# Altium schematic sheet Zigbee_Transceiver_CC2530.SchDoc: Zigbee Transceiver CC2530
size A4; MaxVIN: 3V6; MinVIN: 2V0
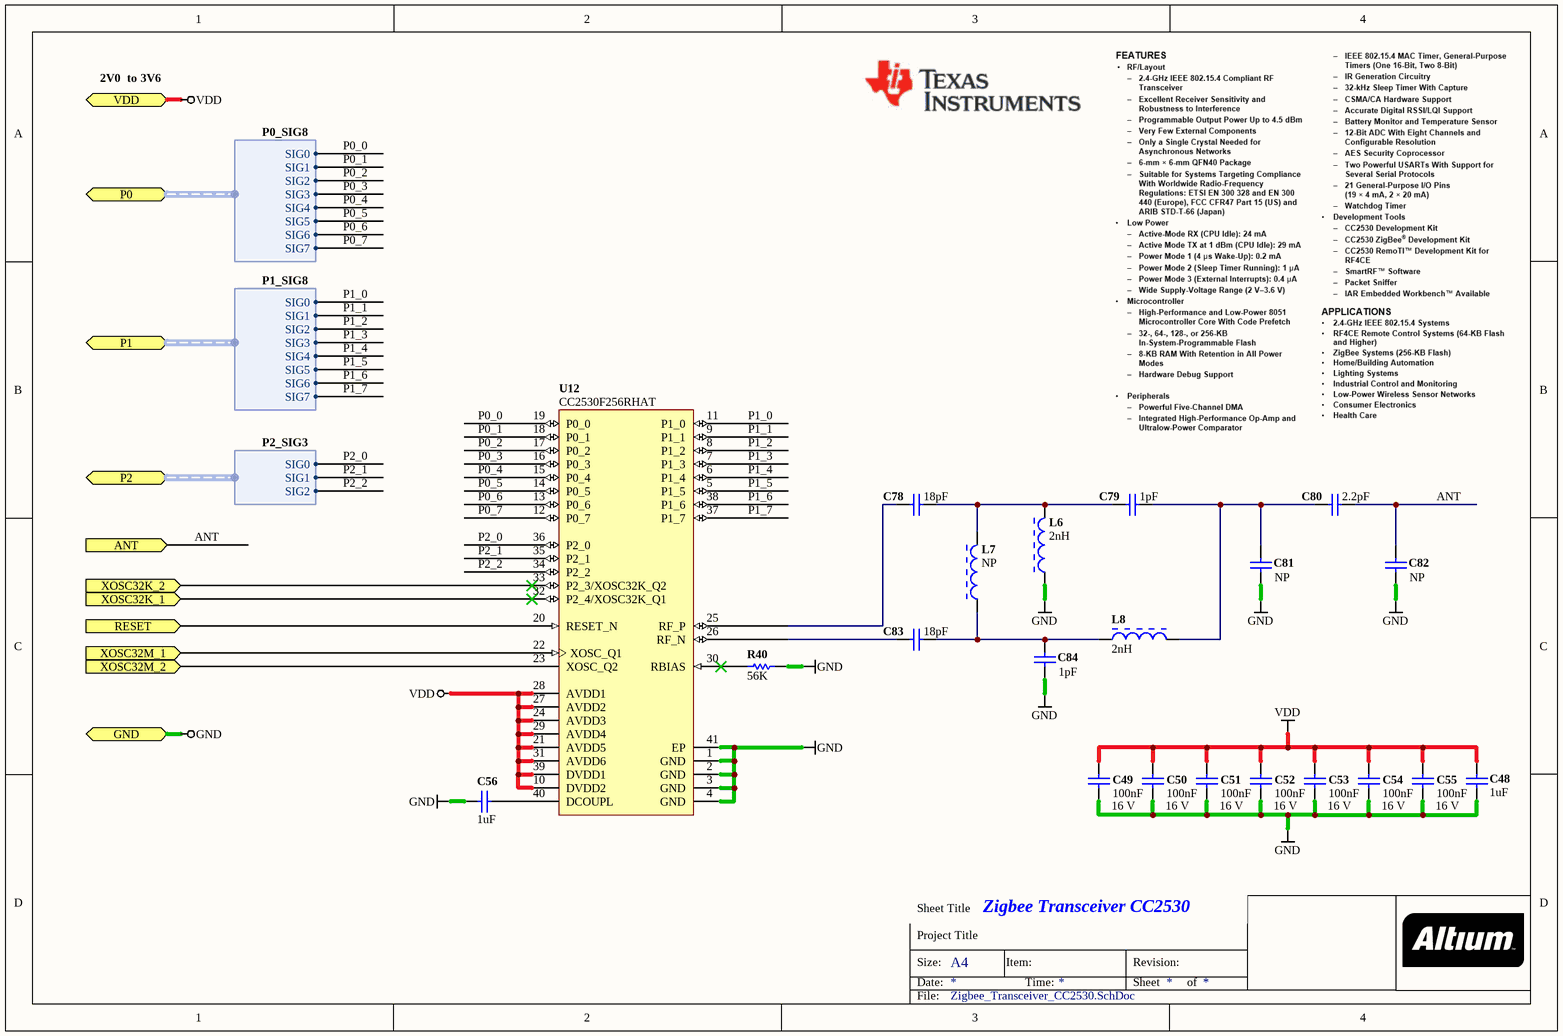
[diagram p0: Zigbee_Transceiver_CC2530.SchDoc]

## Parts
C48  value 1uF  [CAPC0402(1005)60_N]  (hidden comment: CAP 1uF 10V 0402(1005))
C49  value 100nF  Rated Voltage: 16 V  [CAPC0402(1005)60_N]  (hidden comment: CAP 100nF 16V 0402(1005))
C50  value 100nF  Rated Voltage: 16 V  [CAPC0402(1005)60_N]  (hidden comment: CAP 100nF 16V 0402(1005))
C51  value 100nF  Rated Voltage: 16 V  [CAPC0402(1005)60_N]  (hidden comment: CAP 100nF 16V 0402(1005))
C52  value 100nF  Rated Voltage: 16 V  [CAPC0402(1005)60_N]  (hidden comment: CAP 100nF 16V 0402(1005))
C53  value 100nF  Rated Voltage: 16 V  [CAPC0402(1005)60_N]  (hidden comment: CAP 100nF 16V 0402(1005))
C54  value 100nF  Rated Voltage: 16 V  [CAPC0402(1005)60_N]  (hidden comment: CAP 100nF 16V 0402(1005))
C55  value 100nF  Rated Voltage: 16 V  [CAPC0402(1005)60_N]  (hidden comment: CAP 100nF 16V 0402(1005))
C56  value 1uF  [CAPC0402(1005)60_N]  (hidden comment: CAP 1uF 10V 0402(1005))
C78  value 18pF  [CAPC0402(1005)60_N]  (hidden comment: CAP 18pF 25V 0402(1005))
C79  value 1pF  [CAPC0402(1005)60_L]  (hidden comment: CAP 1pF 25V 0402(1005))
C80  value 2.2pF  [CAPC0402(1005)60_L]  (hidden comment: CAP 2.2pF 25V 0402(1005))
C81  NP  [CAPC0402(1005)60_L]
C82  NP  [CAPC0402(1005)60_L]
C83  value 18pF  [CAPC0402(1005)60_N]  (hidden comment: CAP 18pF 25V 0402(1005))
C84  value 1pF  [CAPC0402(1005)60_L]  (hidden comment: CAP 1pF 25V 0402(1005))
L6  2nH  [MURA-IND0402_V]
L7  NP  [MURA-IND0402_V]
L8  2nH  [MURA-IND0402_V]
R40  56K  [RESC0402(1005)_N]
U12  CC2530F256RHAT  [TI-RHA40-4500X4500TP_V]

## Ports
ANT (in), GND, P0 (harness P0_SIG8), P1 (harness P1_SIG8), P2 (harness P2_SIG3), RESET (in), VDD, XOSC32K_1 (in), XOSC32K_2 (in), XOSC32M_1 (in), XOSC32M_2 (in)

## Harnesses
P0_SIG8: SIG0, SIG1, SIG2, SIG3, SIG4, SIG5, SIG6, SIG7
P1_SIG8: SIG0, SIG1, SIG2, SIG3, SIG4, SIG5, SIG6, SIG7
P2_SIG3: SIG0, SIG1, SIG2

## Nets
GND: C48.1 C49.1 C50.1 C51.1 C52.1 C53.1 C54.1 C55.1 C56.1 C81.1 C82.1 C84.2 L6.1 R40.2 U12.1(GND) U12.2(GND) U12.3(GND) U12.4(GND) U12.41(EP) ; port GND
VDD: C48.2 C49.2 C50.2 C51.2 C52.2 C53.2 C54.2 C55.2 U12.10(DVDD2) U12.21(AVDD5) U12.24(AVDD3) U12.27(AVDD2) U12.28(AVDD1) U12.29(AVDD4) U12.31(AVDD6) U12.39(DVDD1) ; port VDD
ANT: C80.2 C82.2 ; port ANT
P0_0: U12.19(P0_0) ; port P0.SIG0
P0_1: U12.18(P0_1) ; port P0.SIG1
P0_2: U12.17(P0_2) ; port P0.SIG2
P0_3: U12.16(P0_3) ; port P0.SIG3
P0_4: U12.15(P0_4) ; port P0.SIG4
P0_5: U12.14(P0_5) ; port P0.SIG5
P0_6: U12.13(P0_6) ; port P0.SIG6
P0_7: U12.12(P0_7) ; port P0.SIG7
P1_0: U12.11(P1_0) ; port P1.SIG0
P1_1: U12.9(P1_1) ; port P1.SIG1
P1_2: U12.8(P1_2) ; port P1.SIG2
P1_3: U12.7(P1_3) ; port P1.SIG3
P1_4: U12.6(P1_4) ; port P1.SIG4
P1_5: U12.5(P1_5) ; port P1.SIG5
P1_6: U12.38(P1_6) ; port P1.SIG6
P1_7: U12.37(P1_7) ; port P1.SIG7
P2_0: U12.36(P2_0) ; port P2.SIG0
P2_1: U12.35(P2_1) ; port P2.SIG1
P2_2: U12.34(P2_2) ; port P2.SIG2
RESET: U12.20(RESET_N) ; port RESET
XOSC32K_1: U12.32(P2_4/XOSC32K_Q1) ; port XOSC32K_1
XOSC32K_2: U12.33(P2_3/XOSC32K_Q2) ; port XOSC32K_2
XOSC32M_1: U12.22(XOSC_Q1) ; port XOSC32M_1
XOSC32M_2: U12.23(XOSC_Q2) ; port XOSC32M_2
NetC56_2: C56.2 U12.40(DCOUPL)
NetC78_1: C78.1 C79.2 L6.2 L7.2
NetC78_2: C78.2 U12.25(RF_P)
NetC79_1: C79.1 C80.1 C81.2 L8.2
NetC83_1: C83.1 C84.1 L7.1 L8.1
NetC83_2: C83.2 U12.26(RF_N)
NetR40_1: R40.1 U12.30(RBIAS)

## Notes on the sheet
- to
- Sheet Title
- Project Title
- Size:
- Date:
- A4
- Item:
- Time:
- Revision:
- Sheet
- of
- File:

## Library data of the parts
C48 C56 = CMP-1034-02116-1: CAP 1uF 10V ±10% 0402 (1005 Metric) Thickness 0.6mm SMD; Case-Metric: 1005; Case-EIA: 0402; Technology: SMT; Max Thickness: 0.6 mm; Rated Voltage: 10 V; Tolerance: ±10%
C49-C55 = CMP-1034-02069-1: CAP 100nF 16V ±10% 0402 (1005 Metric) Thickness 0.6mm SMD; Case-EIA: 0402; Case-Metric: 1005; Max Thickness: 0.6 mm; Tolerance: ±10%; Technology: SMT
C78 C83 = CMP-1034-00856-1: CAP 18pF 25V ±1% 0402 (1005 Metric) Thickness 0.6mm SMD; Case-EIA: 0402; Case-Metric: 1005; Tolerance: ±1%; Max Thickness: 0.6 mm; Technology: SMT; Rated Voltage: 25 V
C79 C84 = CMP-1034-00054-1: CAP 1pF 25V ±0.25pF 0402 (1005 Metric) Thickness 0.6mm SMD; Case-EIA: 0402; Case-Metric: 1005; Technology: SMT; Max Thickness: 0.6 mm; Rated Voltage: 25 V; Tolerance: ±0.25pF
C80-C82 = CMP-1034-00171-1: CAP 2.2pF 25V ±0.25pF 0402 (1005 Metric) Thickness 0.6mm SMD; Case-Metric: 1005; Case-EIA: 0402; Max Thickness: 0.6 mm; Tolerance: ±0.25pF; Rated Voltage: 25 V; Technology: SMT
  C81 C82: Value: 2.2pF
L6-L8 = CMP-0499-00001-2: Chip Inductor (Chip Coil) for High Frequency Multilayer, 2 +/- 0.3 nH, 300mA, 0402 (1005), 180mm Paper Tape; Manufacturer: Murata; PartNumber: LQG15HS2N0S02D; Max. of DC Resistance: 0.1 ohm; Q Test Frequency: 100 MHz; Inductance: 2.0 nH +/- 0.3 nH; Q (min.): 8; Self Resonance Frequency (min.): 6000 MHz; PackageReference: IND0402; PackageDescription: 2-Pin SMT Inductor, 1 x 0.5 mm Body; Operating Temperature Range: -55 to 125 degC; ComponentLink2URL: http://search.murata.co.jp/Ceramy/image/img/PDF/ENG/L0075S0083LQG15HS.pdf; ComponentLink1URL: http://www.murata.com/; RoHS: Yes; ComponentLink3Description: Package Specification; Mounting Technology: Surface Mount; ComponentLink2Description: Datasheet; Rated Current (Itemp) (Based on Temperature Rise): 300 mA; ComponentLink3URL: http://search.murata.co.jp/Ceramy/image/img/PDF/ENG/L0075S0083LQG15HS.pdf; ComponentLink1Description: Manufacturer URL; Inductance Test Frequency: 100 MHz
R40 = CMP-1011-00708-1: 56K 0.063W 1% 0402 (1005 Metric)  SMD; Value: 56000.00 Ohm; Case-EIA: 0402; Case-Metric: 1005; Tolerance: 1 %; Power: 0.063 W; Technology: SMT
U12 = CMP-0458-00002-1: CC2530 System-on-Chip Solution for 2.4-GHz IEEE 802.15.4 and ZigBee Applications; Manufacturer: Texas Instruments; Pin/Package: 40VQFN; Operating Voltage (Max) (V): 3.6; Sensitivity (Best) (dBm): -97; Wakeup Time (PD-->RX/TX) (us): 600; Operating Voltage (Min) (V): 2; Modulation Techniques: DSSS; Antenna Connection: Differential; Standby Current (uA): 0.4; TX Power (dBm): 4.5; RX Current (Lowest) (mA): 20.5; Flash size (KB): 256; Data Rate (Max) (kbps): 250; RAM Size (KB): 8; Frequency Range: 2.4GHz; ComponentLink2Description: Datasheet; PackageReference: S-PVQFN-N40; ComponentLink3URL: http://www.ti.com/lit/ml/mpqf135c/mpqf135c.pdf; ComponentLink1Description: Manufacturer URL; DatasheetVersion: SWRS081B; PartNumber: CC2530F256RHAT; Device Type: System-on-Chip; PackageDescription: 40-Pin Quad Flat No-Lead Package, Body 6 x 6mm, Pitch 0.5mm; ComponentLink1URL: http://www.ti.com/; ComponentLink2URL: http://www.ti.com/lit/ds/symlink/cc2530.pdf; Mounting Technology: Surface Mount; ComponentLink3Description: Package Specification; PackageVersion: 4204276/E